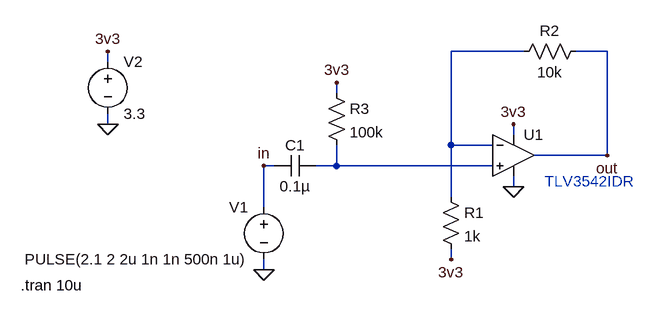
[diagram p0: schematic rf_det_out_amp.asc]
rf_det_out_amp.asc, the LTspice schematic file:
Version 4
SHEET 1 880 680
WIRE 320 -48 208 -48
WIRE 448 -48 400 -48
WIRE -320 -32 -320 -48
WIRE 32 16 32 0
WIRE -320 64 -320 48
WIRE 304 80 304 64
WIRE 208 96 208 -48
WIRE 272 96 208 96
WIRE 448 112 448 -48
WIRE 448 112 336 112
WIRE -64 128 -80 128
WIRE 32 128 32 96
WIRE 32 128 0 128
WIRE 272 128 32 128
WIRE 304 160 304 144
WIRE 208 176 208 96
WIRE -80 192 -80 128
WIRE 208 272 208 256
WIRE -80 288 -80 272
FLAG 304 64 3v3
FLAG 304 160 0
FLAG 448 112 out
FLAG -80 128 in
FLAG -80 288 0
FLAG -320 64 0
FLAG -320 -48 3v3
FLAG 32 0 3v3
FLAG 208 272 3v3
SYMBOL OpAmps\\UniversalOpAmp2 304 112 R0
SYMATTR InstName U1
SYMATTR Value2 Avol=1Meg GBW=100Meg Slew=150Meg
SYMBOL cap 0 112 R90
WINDOW 0 0 32 VBottom 2
WINDOW 3 32 32 VTop 2
SYMATTR InstName C1
SYMATTR Value 0.1µ
SYMBOL res 192 160 R0
SYMATTR InstName R1
SYMATTR Value 1k
SYMBOL res 416 -64 R90
WINDOW 0 0 56 VBottom 2
WINDOW 3 32 56 VTop 2
SYMATTR InstName R2
SYMATTR Value 10k
SYMBOL voltage -80 176 M0
WINDOW 123 0 0 Left 0
WINDOW 39 0 0 Left 0
SYMATTR InstName V1
SYMATTR Value PULSE(2.1 2 2u 1n 1n 500n 1u)
SYMBOL voltage -320 -48 R0
WINDOW 123 0 0 Left 0
WINDOW 39 0 0 Left 0
SYMATTR InstName V2
SYMATTR Value 3.3
SYMBOL res 16 0 R0
SYMATTR InstName R3
SYMATTR Value 100k
TEXT 352 152 Left 2 ;TLV3542IDR
TEXT -454 312 Left 2 !.tran 10u

The netlist it stands for:
* rf_det_out_amp.asc
XU1 N002 N001 3v3 0 out level2 Avol=1Meg GBW=100Meg Slew=150Meg Ilimit=25m Rail=0 Vos=0 En=0 Enk=0 In=0 Ink=0 Rin=500Meg  ; pins In+ In- V+ V- OUT
C1 N002 in 0.1µ
R1 N001 3v3 1k
R2 out N001 10k
V1 in 0 PULSE(2.1 2 2u 1n 1n 500n 1u)
V2 3v3 0 3.3
R3 3v3 N002 100k
* TLV3542IDR
.tran 10u
.lib UniversalOpAmp2.lib
.backanno
.end